# Altium schematic sheet knixx_SW4_00.SchDoc: KNIXX_SW4
size A3; Date: 19/04/2016; DrawnBy: Wim Van Gool; Revision: 00; SheetNumber: 1; SheetTotal: 1; PageSetup: Record=PageOptions|CenterHorizontal=True|CenterVertical=True|PrintScale=0.70|XCorrection=1.00|YCorrection=1.00|PrintKind=1|BorderSize=5000000|LeftOffset=0|BottomOffset=0|Orientation=2|PaperLength=1000|PaperWidth=1000|Scale=100|PaperSource=15|PrintQuality=600|MediaType=1|DitherType=10|PrintScaleMode=1|PaperKind=A4 (210 x 297 mm)|PaperIndex=9
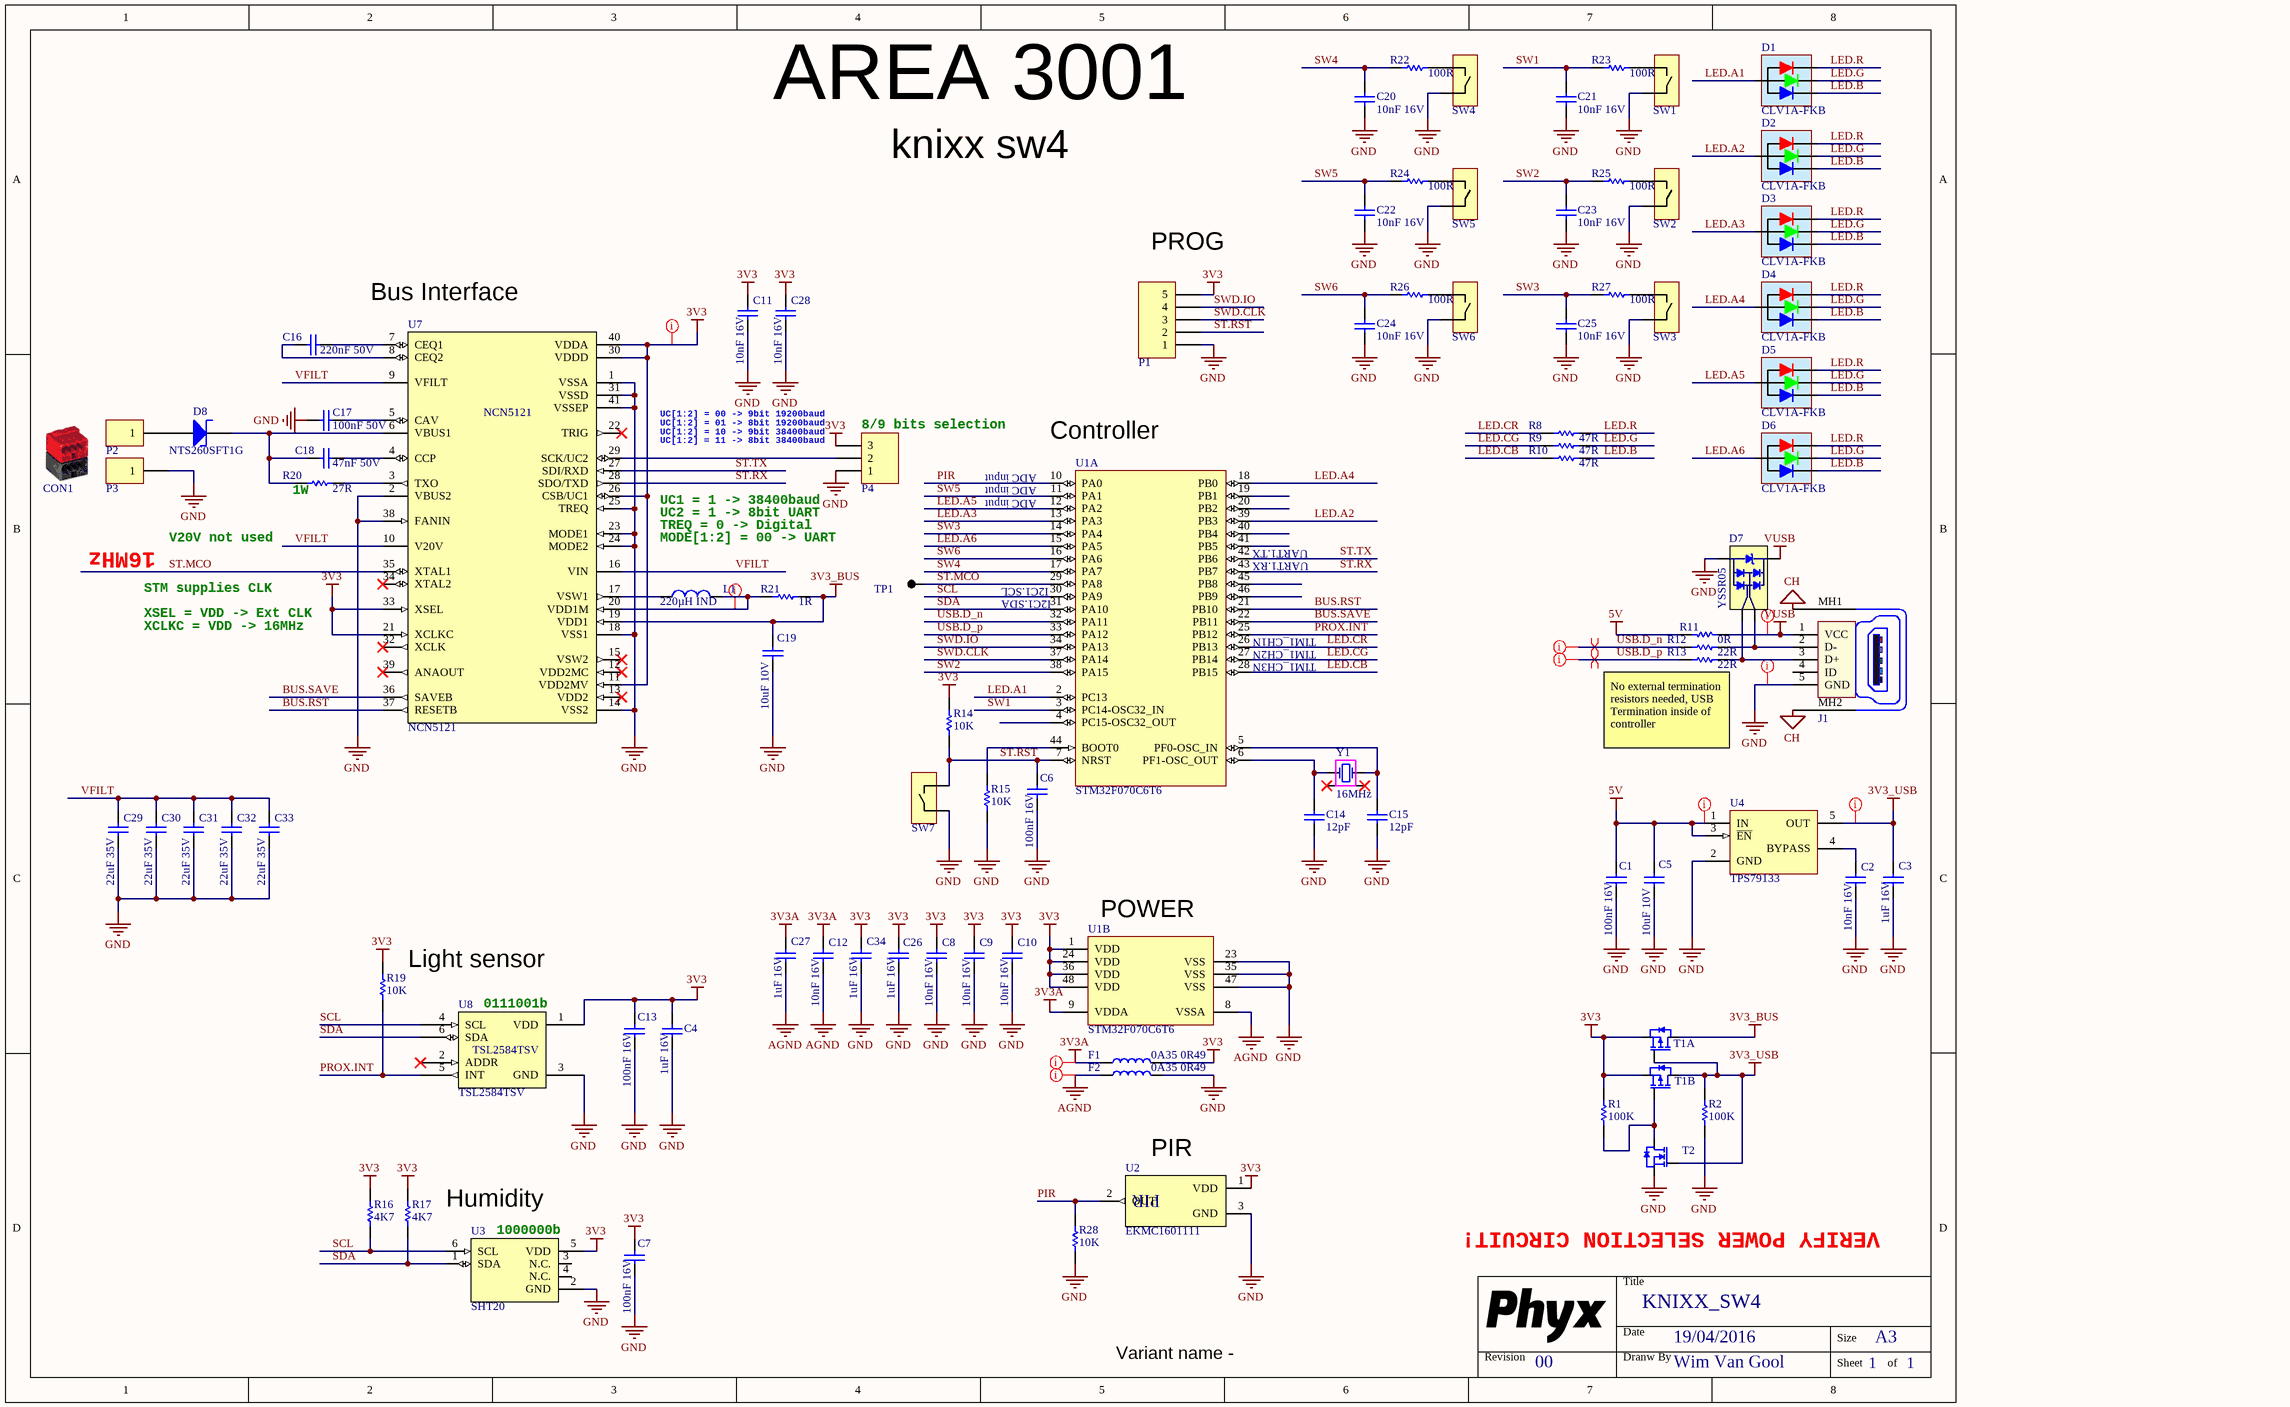
[diagram p0: knixx_SW4_00.SchDoc]

## Parts
C1  value 100nF 16V  [C0402]  (hidden comment: CAP_CERAMIC)
C2  value 10nF 16V  [C0402]  (hidden comment: CAP_CERAMIC)
C3  value 1uF 16V  [C0603_N]  (hidden comment: CAP_CERAMIC)
C4  value 1uF 16V  [C0603_N]  (hidden comment: CAP_CERAMIC)
C5  value 10uF 10V  [C0805_N]  (hidden comment: CAP_CERAMIC)
C6  value 100nF 16V  [C0402]  (hidden comment: CAP_CERAMIC)
C7  value 100nF 16V  [C0402]  (hidden comment: CAP_CERAMIC)
C8  value 10nF 16V  [C0402]  (hidden comment: CAP_CERAMIC)
C9  value 10nF 16V  [C0402]  (hidden comment: CAP_CERAMIC)
C10  value 10nF 16V  [C0402]  (hidden comment: CAP_CERAMIC)
C11  value 10nF 16V  [C0402]  (hidden comment: CAP_CERAMIC)
C12  value 10nF 16V  [C0402]  (hidden comment: CAP_CERAMIC)
C13  value 100nF 16V  [C0402]  (hidden comment: CAP_CERAMIC)
C14  value 12pF  [C0402]  (hidden comment: CAP_CERAMIC)
C15  value 12pF  [C0402]  (hidden comment: CAP_CERAMIC)
C16  value 220nF 50V  [C0805_N]  (hidden comment: CAP_CERAMIC)
C17  value 100nF 50V  [C0603_N]  (hidden comment: CAP_CERAMIC)
C18  value 47nF 50V  [C0603_N]  (hidden comment: CAP_CERAMIC)
C19  value 10uF 10V  [C0805_N]  (hidden comment: CAP_CERAMIC)
C20  value 10nF 16V  [C0402]  (hidden comment: CAP_CERAMIC)
C21  value 10nF 16V  [C0402]  (hidden comment: CAP_CERAMIC)
C22  value 10nF 16V  [C0402]  (hidden comment: CAP_CERAMIC)
C23  value 10nF 16V  [C0402]  (hidden comment: CAP_CERAMIC)
C24  value 10nF 16V  [C0402]  (hidden comment: CAP_CERAMIC)
C25  value 10nF 16V  [C0402]  (hidden comment: CAP_CERAMIC)
C26  value 1uF 16V  [C0603_N]  (hidden comment: CAP_CERAMIC)
C27  value 1uF 16V  [C0603_N]  (hidden comment: CAP_CERAMIC)
C28  value 10nF 16V  [C0402]  (hidden comment: CAP_CERAMIC)
C29  value 22uF 35V  [C1206_N]  (hidden comment: CAP_CERAMIC)
C30  value 22uF 35V  [C1206_N]  (hidden comment: CAP_CERAMIC)
C31  value 22uF 35V  [C1206_N]  (hidden comment: CAP_CERAMIC)
C32  value 22uF 35V  [C1206_N]  (hidden comment: CAP_CERAMIC)
C33  value 22uF 35V  [C1206_N]  (hidden comment: CAP_CERAMIC)
C34  value 1uF 16V  [C0603_N]  (hidden comment: CAP_CERAMIC)
CON1  CONNECTOR FOR EIB APPLICATIONS PUSH-WIRE® CONNECTION  [WAGO_243-211]  (value not drawn)
D1  value CLV1A-FKB  [Cree_CLV1A-FKB]  (hidden comment: PLCC2 general purpose RGB LED Cree CLV1A-FKB)
D2  value CLV1A-FKB  [Cree_CLV1A-FKB]  (hidden comment: PLCC2 general purpose RGB LED Cree CLV1A-FKB)
D3  value CLV1A-FKB  [Cree_CLV1A-FKB]  (hidden comment: PLCC2 general purpose RGB LED Cree CLV1A-FKB)
D4  value CLV1A-FKB  [Cree_CLV1A-FKB]  (hidden comment: PLCC2 general purpose RGB LED Cree CLV1A-FKB)
D5  value CLV1A-FKB  [Cree_CLV1A-FKB]  (hidden comment: PLCC2 general purpose RGB LED Cree CLV1A-FKB)
D6  value CLV1A-FKB  [Cree_CLV1A-FKB]  (hidden comment: PLCC2 general purpose RGB LED Cree CLV1A-FKB)
D7  value YSSR05  [SOT-143]  (hidden comment: Low Capacitanse TVS Diode array)
D8  value NTS260SFT1G  [ON_SOD-123FL]  (hidden comment: NTS260SFT1G  Schottky Rectifier, Single, 60 V, 2 A, SOD-123, 650 mV)
F1  value 0A35 0R49  [L0402]  (hidden comment: BLM15AX102SN1D)
F2  value 0A35 0R49  [L0402]  (hidden comment: BLM15AX102SN1D)
J1  Vertical Micro USB B 614105150721  [WE_614105150721]  (value not drawn)
L1  value 220µH IND  [IND_6045]  (hidden comment: 220µH INDUCTOR)
P1  Header 1.0mm Shrouded 5  [WE_665305124022]  (value not drawn)
P2  SOLDER PIN FOR PCBS UP TO 2 MM  [WAGO_243-131]  (value not drawn)
P3  SOLDER PIN FOR PCBS UP TO 2 MM  [WAGO_243-131]  (value not drawn)
P4  3 pin Solder SW Circular 1mm  [SOLDER_SW_C_1MM_3]  (value not drawn)
R1  value 100K  [R0402]  (hidden comment: RESISTOR)
R2  value 100K  [R0402]  (hidden comment: RESISTOR)
R8  value 47R  [R0402]  (hidden comment: RESISTOR)
R9  value 47R  [R0402]  (hidden comment: RESISTOR)
R10  value 47R  [R0402]  (hidden comment: RESISTOR)
R11  value 0R  [R0603_N]  (hidden comment: RESISTOR)
R12  value 22R  [R0402]  (hidden comment: RESISTOR)
R13  value 22R  [R0402]  (hidden comment: RESISTOR)
R14  value 10K  [R0402]  (hidden comment: RESISTOR)
R15  value 10K  [R0402]  (hidden comment: RESISTOR)
R16  value 4K7  [R0402]  (hidden comment: RESISTOR)
R17  value 4K7  [R0402]  (hidden comment: RESISTOR)
R19  value 10K  [R0402]  (hidden comment: RESISTOR)
R20  value 27R  [R2512]  (hidden comment: RESISTOR)
R21  value 1R  [R0402]  (hidden comment: RESISTOR)
R22  value 100R  [R0402]  (hidden comment: RESISTOR)
R23  value 100R  [R0402]  (hidden comment: RESISTOR)
R24  value 100R  [R0402]  (hidden comment: RESISTOR)
R25  value 100R  [R0402]  (hidden comment: RESISTOR)
R26  value 100R  [R0402]  (hidden comment: RESISTOR)
R27  value 100R  [R0402]  (hidden comment: RESISTOR)
R28  value 10K  [R0402]  (hidden comment: RESISTOR)
SW1  Sealed Tact Switch for SMT 6,2x6,2x7,7  [CK_KSC6xxJ]  (value not drawn)
SW2  Sealed Tact Switch for SMT 6,2x6,2x7,7  [CK_KSC6xxJ]  (value not drawn)
SW3  Sealed Tact Switch for SMT 6,2x6,2x7,7  [CK_KSC6xxJ]  (value not drawn)
SW4  Sealed Tact Switch for SMT 6,2x6,2x7,7  [CK_KSC6xxJ]  (value not drawn)
SW5  Sealed Tact Switch for SMT 6,2x6,2x7,7  [CK_KSC6xxJ]  (value not drawn)
SW6  Sealed Tact Switch for SMT 6,2x6,2x7,7  [CK_KSC6xxJ]  (value not drawn)
SW7  LP SMD tact sw  [CK_KMR4]  (value not drawn)
T1  0.8A Dual P-Ch MOSGET Vgs -1.2  [SOT-363]  (value not drawn)  (parts A,B of 2)
T2  0.2A N-Ch MOSFET Vgs 3.2  [SOT23-3]  (value not drawn)
TP1  TEST_PAD  [TP_0.8mm]  (value not drawn)
U1  value STM32F070C6T6  [STM_LQFP48_N]  (hidden comment: Entry-level ARM Cortex-M0 Value line MCU with up to 32 Kbytes Flash, 48 MHz CPU, USB)  (parts A,B of 2)
U2  value EKMC1601111  [PAN_EKMC1601111]  (hidden comment: PIR 5m White)
U3  value SHT20  [SNS_DFN6]  (hidden comment: Sensirion SHT20 temperature and humidity sensor I2C)
U4  value TPS79133  [TI_DBV_R-PDSO-G5]  (hidden comment: 3V3 100mA Ultra Low Noise LDO)
U7  value NCN5121  [ONS_QFN40_6x6]  (hidden comment: KNX Transceiver for Twisted Pair Networks)
U8  value TSL2584TSV  [AMS_6TSV]  (hidden comment: TSL2584TSV Light-to-Digital Device)
Y1  value 16MHz  [ABMM2]  (hidden comment: 16MHZ ABMM2)

## Nets
3V3: C4.1 C7.1 C8.1 C9.1 C10.1 C11.1 C13.1 C26.1 C28.1 C34.1 F1.2 P1.5 P4.3 R1.1 R14.1 R16.1 R17.1 R19.1 T1.1(S) T1.4(S) U1.1(VDD) U1.24(VDD) U1.36(VDD) U1.48(VDD) U2.1(VDD) U3.5(VDD) U7.11(VDD2MV) U7.21(XCLKC) U7.26(CSB/UC1) U7.30(VDDD) U7.33(XSEL) U7.40(VDDA) U8.1(VDD)
3V3_BUS: C19.1 R21.1 T1.6(D) U7.19(VDD1)
3V3_USB: C3.1 R2.1 T1.2(G) T1.3(D) T2.1(G) U4.5(OUT)
3V3A: C12.1 C27.1 F1.1 U1.9(VDDA)
5V: C1.1 C5.1 R11.2 U4.1(IN) U4.3(~{EN})
AGND: C12.2 C27.2 F2.1 U1.8(VSSA)
CH: J1.MH1 J1.MH2
GND: C1.2 C2.2 C3.2 C4.2 C5.2 C6.2 C7.2 C8.2 C9.2 C10.2 C11.2 C13.2 C14.2 C15.2 C17.2 C19.2 C20.2 C21.2 C22.2 C23.2 C24.2 C25.2 C26.2 C28.2 C29.2 C30.2 C31.2 C32.2 C33.2 C34.2 D7.1 F2.2 J1.5(GND) P1.1 P3.1 P4.1 R2.2 R15.2 R28.2 SW1.2 SW2.2 SW3.2 SW4.2 SW5.2 SW6.2 SW7.2 T2.2(S) U1.23(VSS) U1.35(VSS) U1.47(VSS) U2.3(GND) U3.2(GND) U4.2(GND) U7.1(VSSA) U7.2(VBUS2) U7.14(VSS2) U7.18(VSS1) U7.23(MODE1) U7.24(MODE2) U7.25(TREQ) U7.31(VSSD) U7.38(FANIN) U7.41(VSSEP) U8.3(GND)
VUSB: D7.4 J1.1(VCC) R11.1
BUS.RST: U1.21(PB10) U7.37(RESETB)
BUS.SAVE: U1.22(PB11) U7.36(SAVEB)
LED.A1: D1.2(A) U1.2(PC13)
LED.A2: D2.2(A) U1.39(PB3)
LED.A3: D3.2(A) U1.13(PA3)
LED.A4: D4.2(A) U1.18(PB0)
LED.A5: D5.2(A) U1.12(PA2)
LED.A6: D6.2(A) U1.15(PA5)
LED.B: D1.3(BC) D2.3(BC) D3.3(BC) D4.3(BC) D5.3(BC) D6.3(BC) R10.1
LED.CB: R10.2 U1.28(PB15)
LED.CG: R9.2 U1.27(PB14)
LED.CR: R8.2 U1.26(PB13)
LED.G: D1.4(GC) D2.4(GC) D3.4(GC) D4.4(GC) D5.4(GC) D6.4(GC) R9.1
LED.R: D1.1(RC) D2.1(RC) D3.1(RC) D4.1(RC) D5.1(RC) D6.1(RC) R8.1
PIR: R28.1 U1.10(PA0) U2.2(OUT)
PROX.INT: R19.2 U1.25(PB12) U8.5(INT)
SCL: R16.2 U1.30(PA9) U3.6(SCL) U8.4(SCL)
SDA: R17.2 U1.31(PA10) U3.1(SDA) U8.6(SDA)
ST.MCO: TP1.1 U1.29(PA8) U7.35(XTAL1)
ST.RST: C6.1 P1.2 R14.2 SW7.1 U1.7(NRST)
ST.RX: U1.43(PB7) U7.28(SDO/TXD)
ST.TX: U1.42(PB6) U7.27(SDI/RXD)
SW1: C21.1 R23.2 U1.3(PC14-OSC32_IN)
SW2: C23.1 R25.2 U1.38(PA15)
SW3: C25.1 R27.2 U1.14(PA4)
SW4: C20.1 R22.2 U1.17(PA7)
SW5: C22.1 R24.2 U1.11(PA1)
SW6: C24.1 R26.2 U1.16(PA6)
SWD.CLK: P1.3 U1.37(PA14)
SWD.IO: P1.4 U1.34(PA13)
USB.D_n: R12.2 U1.32(PA11)
USB.D_p: R13.2 U1.33(PA12)
VFILT: C29.1 C30.1 C31.1 C32.1 C33.1 U7.9(VFILT) U7.10(V20V) U7.16(VIN)
NetC2_1: C2.1 U4.4(BYPASS)
NetC14_1: C14.1 U1.6(PF1-OSC_OUT) Y1.1(OSC1)
NetC15_1: C15.1 U1.5(PF0-OSC_IN) Y1.3(OSC3)
NetC16_1: C16.1 U7.7(CEQ1)
NetC16_2: C16.2 U7.8(CEQ2)
NetC17_1: C17.1 U7.5(CAV)
NetC18_1: C18.1 U7.4(CCP)
NetC18_2: C18.2 D8.1(C) R20.2 U7.6(VBUS1)
NetD7_2: D7.2 J1.3(D+) R13.1
NetD7_3: D7.3 J1.2(D-) R12.1
NetD8_2: D8.2(A) P2.1
NetL1_1: L1.1 U7.17(VSW1)
NetL1_2: L1.2 R21.2 U7.20(VDD1M)
NetP4_2: P4.2 U7.29(SCK/UC2)
NetR1_2: R1.2 T1.5(G) T2.3(D)
NetR15_1: R15.1 U1.44(BOOT0)
NetR20_1: R20.1 U7.3(TXO)
NetR22_1: R22.1 SW4.1
NetR23_1: R23.1 SW1.1
NetR24_1: R24.1 SW5.1
NetR25_1: R25.1 SW2.1
NetR26_1: R26.1 SW6.1
NetR27_1: R27.1 SW3.1

Not connected (* = marked no-connect by the designer): J1 4(ID); U1 4(PC15-OSC32_OUT) 19(PB1) 20(PB2) 40(PB4) 41(PB5) 45(PB8) 46(PB9); U3 3(N.C.) 4(N.C.); U7 12(VDD2MC)* 13(VDD2)* 15(VSW2)* 22(TRIG)* 32(XCLK)* 34(XTAL2)* 39(ANAOUT)*; U8 2(ADDR)*; Y1 2(GND1)* 4(GND2)*

## Layout directives
net class POWER: 3V3, 3V3_USB, 3V3A, 5V, AGND, GND, NetL1_2, VUSB
differential pair: USB.D_n, USB.D_p
net class 90r: USB.D_n, USB.D_p

## Notes on the sheet
- AREA 3001
- knixx sw4
- (near P1) PROG
- (near U7) Bus Interface
- UC[1:2] = 00 -> 9bit 19200baud
- UC[1:2] = 01 -> 8bit 19200baud
- UC[1:2] = 10 -> 9bit 38400baud
- UC[1:2] = 11 -> 8bit 38400baud
- (near P4) 8/9 bits selection
- (near U1) ADC input
- (near U1) Controller
- 16MHz
- V20V not used
- (near R20) 1W
- TREQ = 0 -> Digital
- MODE[1:2] = 00 -> UART
- UC1 = 1 -> 38400baud
- UC2 = 1 -> 8bit UART
- (near U1) UART1.TX
- STM supplies CLK
- (near U1) I2C1.SDA
- (near U1) I2C1.SCL
- (near U1) UART1.RX
- XCLKC = VDD -> 16MHz
- XSEL = VDD -> Ext CLK
- (near U1) TIM1_CH1N
- (near U1) TIM1_CH2N
- (near U1) TIM1_CH3N
- (near R13) No external termination resistors needed, USB Termination inside of controller
- (near U1) POWER
- (near R19) Light sensor
- (near U8) 0111001b
- (near U2) PIR
- Humidity
- (near U3) 1000000b
- VERIFY POWER SELECTION CIRCUIT!
- Title
- Variant name -
- Revision
- Date
- Dranw By
- Size
- A3
- Sheet
- of
- (in symbol PIR 5m WH EKMC1601111) PIR

## Library data of the parts
C1 C6 C7 C13 = CAP # 100nF 16V 0402: Capacitor Ceramic; Supplier 1: Farnell; Supplier Part Number 1: 1758896
C2 C8-C12 C20-C25 C28 = CAP # 10nF 16V 0402: Capacitor Ceramic; Supplier 1: Farnell; Supplier Part Number 1: 1758924
C3 C4 C26 C27 C34 = CAP # 1uF 16V 0603: Capacitor Ceramic; Supplier 1: Farnell; Supplier Part Number 1: 2320814
  C26: Description: CAP # 1uF 16V 0603
C5 C19 = CAP # 10uF 10V 0805: Capacitor Ceramic; Supplier 1: Farnell; Supplier Part Number 1: 2320859
C14 C15 = CAP # 12pF 50V 0402: Capacitor Ceramic; Supplier 1: Farnell; Supplier Part Number 1: 2310489
C16 = CAP # 220nF 50V 0805: Capacitor Ceramic; Supplier 1: Farnell; Supplier Part Number 1: 2496964
C17 = CAP # 100nF 50V 0603: Capacitor Ceramic; Supplier 1: Farnell; Supplier Part Number 1: 1759122
C18 = CAP # 47nF 50V 0603: Capacitor Ceramic; Supplier 1: Farnell; Supplier Part Number 1: 2496867
C29-C33 = CAP # 22uF 35V 1206 X5R: Capacitor Ceramic; Description: CAP # 22uF 35V 1206 X5R; Supplier 1: Digikey; Supplier Part Number 1: 445-8045-1-ND
CON1 = Wago 243-211 Connector EIB: Value: 243-211
D1-D6 = LED # RGB PLCC2 CLV1A-FKB: =Description
D7 = TVS # YSSR05: =Description; Supplier 1: China
D8 = Schottky # NTS260SFT1G: =Description; Supplier 1: Farnell; Supplier Part Number 1: 2473419
F1 F2 = FER # 1K 0A35 0402 0R49 BLM15AX102SN1D: Supplier 1: Farnell; Supplier Part Number 1: 2443221
J1 = USB Micro B TH VERTICAL 614105150721: Value: 614105150721
L1 = IND # 10uH 5.2x5.2mm SRU5028-100Y: Supplier 1: Farnell; Supplier Part Number 1: xxx
P1 = HDR # SHR 1.0mm 5way - 665305124022: Value: 665305124022
P2 P3 = Wago 234-131 Solder pin: Value: 243-131
P4 = SW # Solder 3 pin Circular 1mm
R1 R2 = RES # 100K 0402
R8-R10 = RES # 47R 0402
R11 = RES # 0R 0603
R12 R13 = RES # 22R 0402
R14 R15 R19 R28 = RES # 10K 0402
R16 R17 = RES # 4K7 0402
R20 = RES # 27R 2512
R21 = RES # 1R 0402
R22-R27 = RES # 100R 0402
SW1-SW6 = SW # TACT KSC621JLFS: Value: KSC621JLFS; Supplier 1: Farnell
SW7 = SW # KMR4: Value: KMR442GULCLFS; Supplier 1: Farnell
T1 = NTJD4152PT1G  Dual P-Ch MOSFET 0.8A 1.2Vgs 20Vds: =Description; Value: NTJD4152PT1G; Supplier 1: Farnell; Supplier Part Number 1: 2533191
T2 = BSS138 N-Ch MOSFET 0.2A 3.2Vgs 60Vds: Value: BSS138; Supplier 1: Farnell; Supplier Part Number 1: 2432717
TP1 = TP # 0.8mm: Value: NO BOM
U1 = M0 # STM32F070C6T6: =Description; PartNumber: STM32F373CCT6; Core: ARM Cortex-M4; FLASH Size (Prog) (kB): 256; I/Os (High Current): 36; Internal RAM Size (kB): 32; Operating Frequency(F) (Processor speed) (MHz): 72; Packing: Tray; Supply Voltage(Vcc) min (V): 2; DatasheetVersion: Rev. 3; PackageVersion: Rev. 6, 06/2013; PackageReference: LQFP48; PackageDescription: 48-Pin Low Profile Quad Flat Package, 7 x 7 mm Body, 0.5 mm Pitch; Supplier 1: Farnell; Supplier Part Number 1: 2488283; Supplier 2: Farnell; Supplier Part Number 2: 2215117; Supplier 3: Newark; Supplier Part Number 3: 46W2195; Supplier 4: Newark; Supplier Part Number 4: 48W6893; Supplier 5: Mouser; Supplier Part Number 5: 511-STM32F373CCT6; Mounting Technology: Surface Mount; ComponentLink1Description: Manufacturer URL; ComponentLink1URL: http://www.st.com/web/en/home.html; ComponentLink2Description: Datasheet; ComponentLink2URL: http://www.st.com/st-web-ui/static/active/en/resource/technical/document/datasheet/DM00046749.pdf; ComponentLink3Description: Package Specification; ComponentLink3URL: http://www.st.com/st-web-ui/static/active/en/resource/technical/document/datasheet/DM00058181.pdf
U2 = PIR 5m WH EKMC1601111: =Description; Supplier 1: Farnell; Supplier Part Number 1: 2095728
U3 = TMP HUM # SHT20: =Description
U4 = LDO # 3V3 0A1 ULN TPS79133: =Description; Supplier 1: Farnell; Supplier Part Number 1: 8461767
U7 = KNX # NCN5121: =Description
U8 = LGHT # TSL2584TSV: =Description; Supplier 1: Digikey; Supplier Part Number 1: TSL2584TSVTR-ND
Y1 = XTAL # 16Mhz ABMM2: Crystal Oscillator 4pin casing; Supplier 1: Farnell; Supplier Part Number 1: 2101343; Description: XTAL # 16Mhz ABMM2